# Altium project STC8A8KxxS4A12.PrjPcb
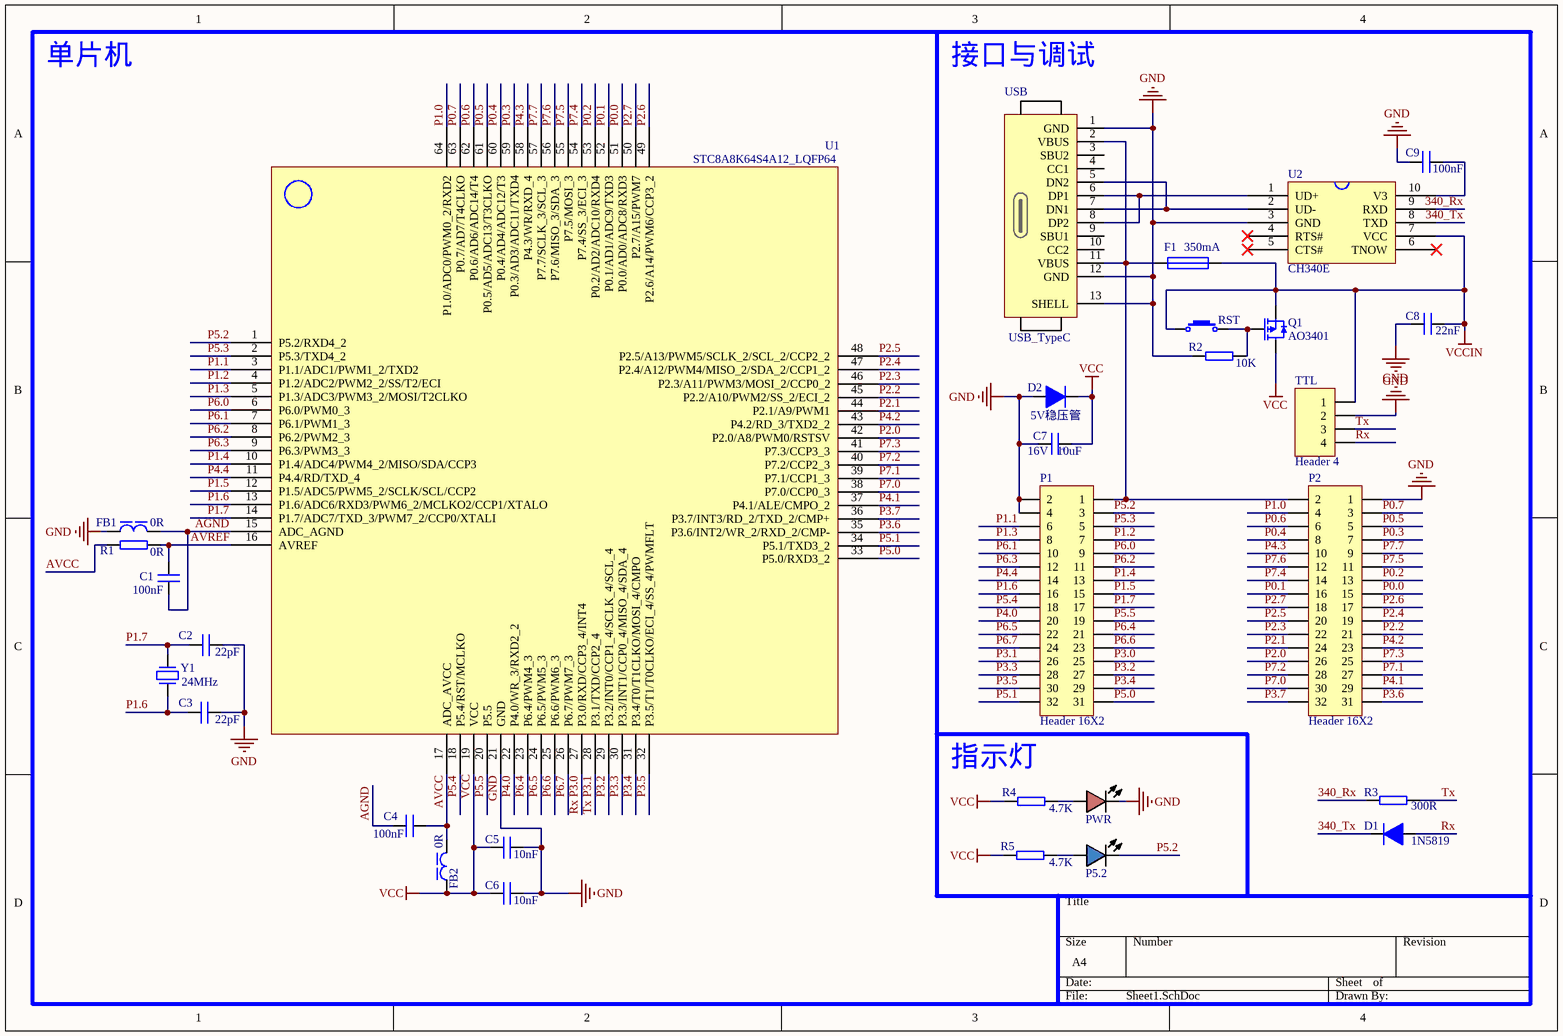
[diagram p0: Sheet1.SchDoc]
1 sheet, 30 parts. Net scope: global (net labels, ports and power ports of the same name join across sheets).
Board file: PCB1.PcbDoc

## Sheet Sheet1.SchDoc
size A4

### Parts
C1  100nF  [0603电容]
C2  22pF  [0603电容]
C3  22pF  [0603电容]
C4  100nF  [0603电容]
C5  10nF  [0603电容]
C6  10nF  [0603电容]
C7  16V   10uF  [Tan1206]
C8  22nF  [0603电容]
C9  100nF  [0603电容]
D1  1N5819  [SOD-323]
D2  5V稳压管  [SOD-323]
F1  350mA  [0603保险丝]
FB1  0R  [0603磁珠]
FB2  0R  [0603磁珠]
P1  Header 16X2  [HDR-16X2]
P2  Header 16X2  [HDR-16X2]
P5.2  Blue_LED  [LED 0603B]  (value not drawn)
PWR  Red_LED  [LED 0603R]  (value not drawn)
Q1  AO3401  [SOT-23]
R1  0R  [0603电阻]
R2  10K  [0603电阻]
R3  300R  [0603电阻]
R4  4.7K  [0603电阻]
R5  4.7K  [0603电阻]
RST  *  [SWD]  (value not drawn)
TTL  Header 4  [HDR-1X4]
U1  STC8A8K64S4A12_LQFP64  [LQFP64-10*10]
U2  CH340E  [MSOP-10]
USB  USB_TypeC  [USB3.1]
Y1  24MHz  [XTAL-SMD3225]

### Nets
GND: C2.2 C3.2 C5.2 C6.2 C7.2(K) C8.1 C9.1 D2.2 FB1.1 P1.2 P1.4 P2.1 PWR.2 R2.1 TTL.2 U1.21(GND) U2.3(GND) USB.1(GND) USB.12(GND) USB.13(SHELL)
VCC: C5.1 C6.1 C7.1(A) D2.1 FB2.1 Q1.2 R4.1 R5.1 U1.19(VCC)
VCCIN: C8.2 F1.2 Q1.3 RST.1 TTL.1 U2.7(VCC)
340_Rx: R3.1 U2.9(RXD)
340_Tx: D1.1 U2.8(TXD)
AGND: C1.2 C4.1 FB1.2 U1.15(ADC_AGND)
AVCC: C4.2 FB2.2 R1.1 U1.17(ADC_AVCC)
AVREF: C1.1 R1.2 U1.16(AVREF)
P0.0: P2.15 U1.51(P0.0/AD0/ADC8/RXD3)
P0.1: P2.16 U1.52(P0.1/AD1/ADC9/TXD3)
P0.2: P2.13 U1.53(P0.2/AD2/ADC10/RXD4)
P0.3: P2.7 U1.59(P0.3/AD3/ADC11/TXD4)
P0.4: P2.8 U1.60(P0.4/AD4/ADC12/T3)
P0.5: P2.5 U1.61(P0.5/AD5/ADC13/T3CLKO)
P0.6: P2.6 U1.62(P0.6/AD6/ADC14/T4)
P0.7: P2.3 U1.63(P0.7/AD7/T4CLKO)
P1.0: P2.4 U1.64(P1.0/ADC0/PWM0_2/RXD2)
P1.1: P1.6 U1.3(P1.1/ADC1/PWM1_2/TXD2)
P1.2: P1.7 U1.4(P1.2/ADC2/PWM2_2/SS/T2/ECI)
P1.3: P1.8 U1.5(P1.3/ADC3/PWM3_2/MOSI/T2CLKO)
P1.4: P1.13 U1.10(P1.4/ADC4/PWM4_2/MISO/SDA/CCP3)
P1.5: P1.15 U1.12(P1.5/ADC5/PWM5_2/SCLK/SCL/CCP2)
P1.6: C3.1 P1.16 U1.13(P1.6/ADC6/RXD3/PWM6_2/MCLKO2/CCP1/XTALO) Y1.1
P1.7: C2.1 P1.17 U1.14(P1.7/ADC7/TXD_3/PWM7_2/CCP0/XTALI) Y1.3
P2.0: P2.26 U1.42(P2.0/A8/PWM0/RSTSV)
P2.1: P2.24 U1.44(P2.1/A9/PWM1)
P2.2: P2.21 U1.45(P2.2/A10/PWM2/SS_2/ECI_2)
P2.3: P2.22 U1.46(P2.3/A11/PWM3/MOSI_2/CCP0_2)
P2.4: P2.19 U1.47(P2.4/A12/PWM4/MISO_2/SDA_2/CCP1_2)
P2.5: P2.20 U1.48(P2.5/A13/PWM5/SCLK_2/SCL_2/CCP2_2)
P2.6: P2.17 U1.49(P2.6/A14/PWM6/CCP3_2)
P2.7: P2.18 U1.50(P2.7/A15/PWM7)
P3.0: D1.2 P1.25 TTL.4 U1.27(P3.0/RXD/CCP3_4/INT4)  [also labelled Rx]
P3.1: P1.26 R3.2 TTL.3 U1.28(P3.1/TXD/CCP2_4)  [also labelled Tx]
P3.2: P1.27 U1.29(P3.2/INT0/CCP1_4/SCLK_4/SCL_4)
P3.3: P1.28 U1.30(P3.3/INT1/CCP0_4/MISO_4/SDA_4)
P3.4: P1.29 U1.31(P3.4/T0/T1CLKO/MOSI_4/CMPO)
P3.5: P1.30 U1.32(P3.5/T1/T0CLKO/ECI_4/SS_4/PWMFLT)
P3.6: P2.31 U1.35(P3.6/INT2/WR_2/RXD_2/CMP-)
P3.7: P2.32 U1.36(P3.7/INT3/RD_2/TXD_2/CMP+)
P4.0: P1.20 U1.22(P4.0/WR_3/RXD2_2)
P4.1: P2.29 U1.37(P4.1/ALE/CMPO_2)
P4.2: P2.23 U1.43(P4.2/RD_3/TXD2_2)
P4.3: P2.10 U1.58(P4.3/WR/RXD_4)
P4.4: P1.14 U1.11(P4.4/RD/TXD_4)
P5.0: P1.31 U1.33(P5.0/RXD3_2)
P5.1: P1.32 U1.34(P5.1/TXD3_2)
P5.2: P1.3 P5.2.2 U1.1(P5.2/RXD4_2)
P5.3: P1.5 U1.2(P5.3/TXD4_2)
P5.4: P1.18 U1.18(P5.4/RST/MCLKO)
P5.5: P1.19 U1.20(P5.5)
P6.0: P1.9 U1.6(P6.0/PWM0_3)
P6.1: P1.10 U1.7(P6.1/PWM1_3)
P6.2: P1.11 U1.8(P6.2/PWM2_3)
P6.3: P1.12 U1.9(P6.3/PWM3_3)
P6.4: P1.21 U1.23(P6.4/PWM4_3)
P6.5: P1.22 U1.24(P6.5/PWM5_3)
P6.6: P1.23 U1.25(P6.6/PWM6_3)
P6.7: P1.24 U1.26(P6.7/PWM7_3)
P7.0: P2.30 U1.38(P7.0/CCP0_3)
P7.1: P2.27 U1.39(P7.1/CCP1_3)
P7.2: P2.28 U1.40(P7.2/CCP2_3)
P7.3: P2.25 U1.41(P7.3/CCP3_3)
P7.4: P2.14 U1.54(P7.4/SS_3/ECI_3)
P7.5: P2.11 U1.55(P7.5/MOSI_3)
P7.6: P2.12 U1.56(P7.6/MISO_3/SDA_3)
P7.7: P2.9 U1.57(P7.7/SCLK_3/SCL_3)
NetC9_2: C9.2 U2.10(V3)
NetF1_1: F1.1 P1.1 P2.2 USB.2(VBUS) USB.11(VBUS)
NetP5.2_1: P5.2.1 R5.2
NetPWR_1: PWR.1 R4.2
NetQ1_1: Q1.1 R2.2 RST.2
NetU2_1: U2.1(UD+) USB.6(DP1) USB.8(DP2)
NetU2_2: U2.2(UD-) USB.5(DN2) USB.7(DN1)

Not connected (* = marked no-connect by the designer): U2 4(RTS#)* 5(CTS#)* 6(TNOW)*; USB 3(SBU2) 4(CC1) 9(SBU1) 10(CC2)

### Notes on the sheet
- 单片机
- 接口与调试
- (near R4) 指示灯
- (in symbol T_Capacitor) +

### Library data of the parts
C1-C6 C8 C9 = Capacitor: 电容; BOM名称: 无极性贴片电容; 版权归属: 源创客; 学习资源: www.ooocke.com
C7 = T_Capacitor: 贴片钽电容; 版权归属: 源创客; BOM名称: 贴片钽电容; 学习资源: www.ooocke.com
F1 = Fuse
FB1 FB2 = FERRITE_BEAD: 磁珠
P1 P2 = Header 16X2: 16*2P接插件; 版权归属: 源创客; BOM名称: 16*2P接插件; 学习资源: www.ooocke.com
Q1 = AO3401: BOM名称: P沟道场效应管; 版权归属: 源创客; 学习资源: www.ooocke.com
R1-R5 = Resistor: 电阻; BOM名称: 贴片电阻; 版权归属: 源创客; 学习资源: www.ooocke.com
RST = SW_TB: 轻触开关
TTL = Header 4: 4P接插件; 版权归属: 源创客; BOM名称: 4P接插件; 学习资源: www.ooocke.com
USB = USB3.1: TypeC接口
Y1 = Crystal: 晶振; BOM名称: 2脚晶振; 版权归属: 源创客; 学习资源: www.ooocke.com